# Altium schematic sheet battery_and_current_sense.SchDoc: Battery and current sense
size A4; SheetNumber: 8; SheetTotal: 20; TitleBig: Battery and current sense; Desc_line1: Two circuit variants that will be implemented but not used simultaneously. The usage of one over the other will come; Desc_line2: by component disponibility. INA219 current sensor is independent and common for both systems.
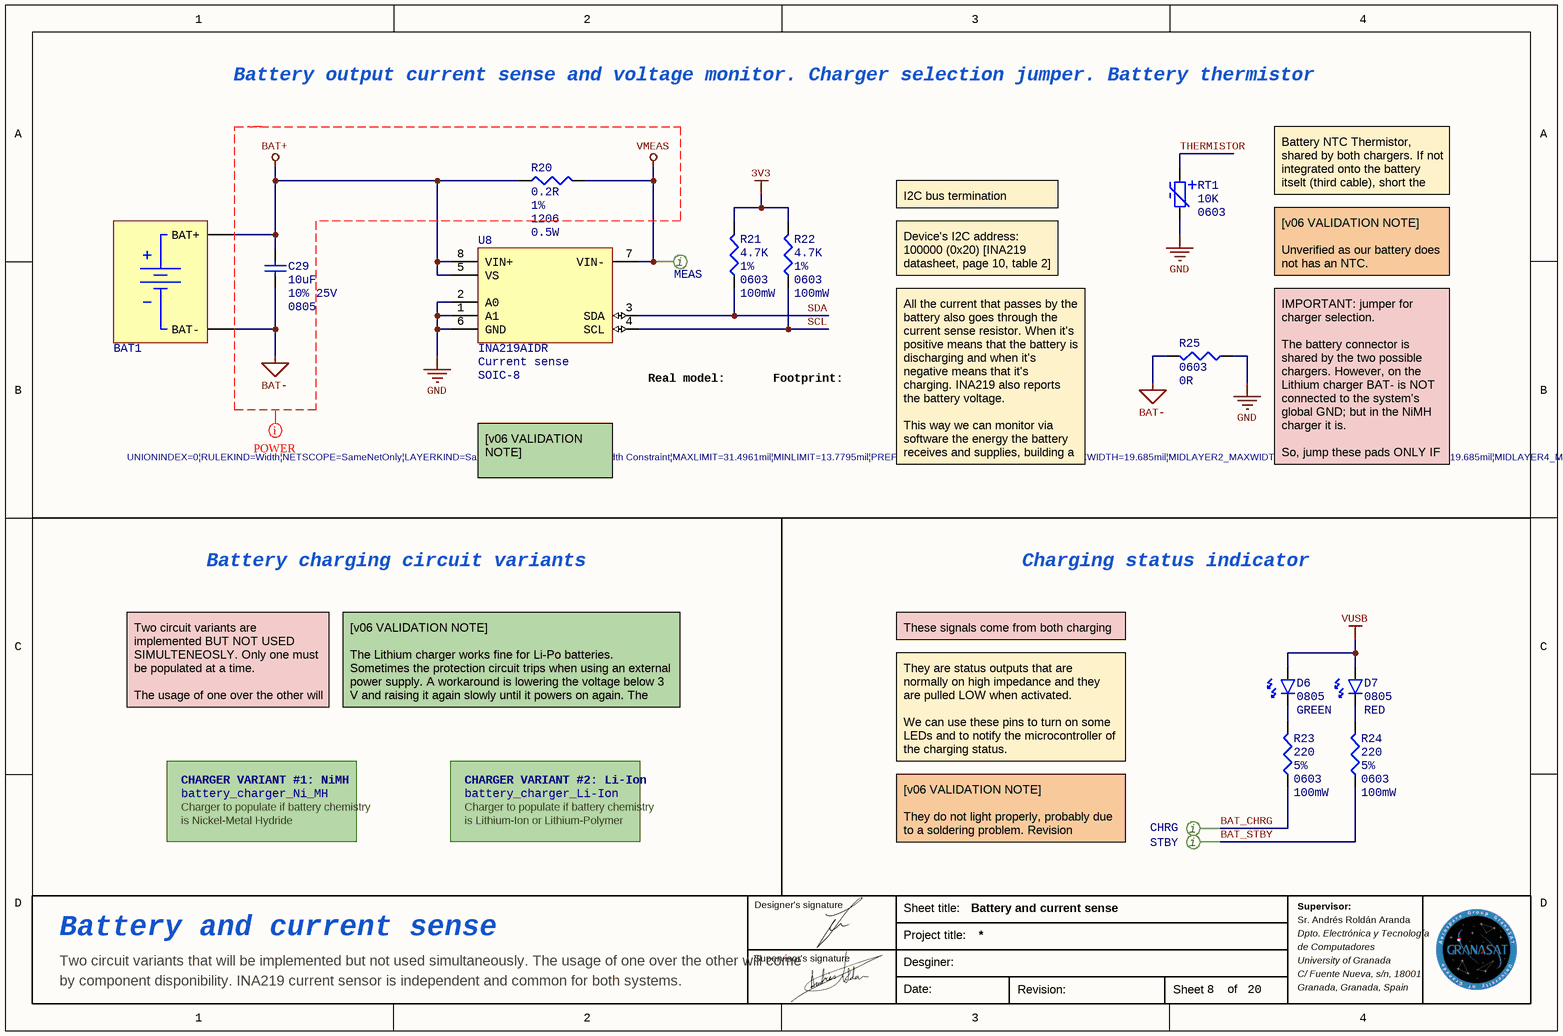
[diagram p0: battery_and_current_sense.SchDoc]

## Parts
BAT1  Battery pads  [BATTERY_PADS]  (value not drawn)  (no BOM)
C29  value 10uF  Tolerance: 10% 25V  PackageDescription: 0805  [CAP 0805_2012]  (hidden comment: Cap_cer_0805)
CHRG  Test Point Pad dual sided  [TEST POINT PAD]  (value not drawn)  (no BOM)
D6  PackageDescription: 0805  Type: GREEN  [LED 0805_2012 GREEN]  (hidden comment: Diode LED_G_0805)
D7  PackageDescription: 0805  Type: RED  [LED 0805_2012 RED]  (hidden comment: Diode LED_R_0805)
MEAS  Test Point Pad dual sided  [TEST POINT PAD]  (value not drawn)  (no BOM)
R20  value 0.2R  Tolerance: 1%  PackageDescription: 1206  PowerDisipated: 0.5W  [RES 1206_3216]  (hidden comment: sense)
R21  value 4.7K  Tolerance: 1%  PackageDescription: 0603  PowerDisipated: 100mW  [RES 0603_1608]  (hidden comment: Res_0603_4.7K_1%_100mW)
R22  value 4.7K  Tolerance: 1%  PackageDescription: 0603  PowerDisipated: 100mW  [RES 0603_1608]  (hidden comment: Res_0603_4.7K_1%_100mW)
R23  value 220  Tolerance: 5%  PackageDescription: 0603  PowerDisipated: 100mW  [RES 0603_1608]  (hidden comment: Res_0603_220_5%_100mW)
R24  value 220  Tolerance: 5%  PackageDescription: 0603  PowerDisipated: 100mW  [RES 0603_1608]  (hidden comment: Res_0603_220_5%_100mW)
R25  value 0R  PackageDescription: 0603  [RES 0603_1608]  (hidden comment: Res_0603_0ohm)
RT1  value 10K  PackageDescription: 0603  [NTC THT ver]  (hidden comment: NTC 10K tht)
STBY  Test Point Pad dual sided  [TEST POINT PAD]  (value not drawn)  (no BOM)
U8  Part: INA219AIDR  Type: Current sense  PackageDescription: SOIC-8  [SOIC-8-D0008A INA219D]  (hidden comment: INA219)

## Sub-sheets
CHARGER VARIANT #1: NiMH = battery_charger_Ni_MH: no entries
CHARGER VARIANT #2: Li-Ion = battery_charger_Li-Ion: no entries

## Nets
3V3: R21.2 R22.2
BAT+: BAT1.2(BAT+) C29.2 R20.1 U8.5(VS) U8.8(VIN+)
BAT-: BAT1.1(BAT-) C29.1 R25.2
GND: R25.1 RT1.2 U8.1(A1) U8.2(A0) U8.6(GND)
VMEAS: MEAS.1 R20.2 U8.7(VIN-)
VUSB: D6.1 D7.1
BAT_CHRG: CHRG.1 R23.1
BAT_STBY: R24.1 STBY.1
SCL: R22.1 U8.4(SCL)
SDA: R21.1 U8.3(SDA)
THERMISTOR: RT1.1
NetD6_2: D6.2 R23.2
NetD7_2: D7.2 R24.2

## Layout directives
net class POWER; rule Width Constraint [Pref Width = 0.5mm    Min Width = 0.35mm    Max Width = 0.8mm]: BAT+, BAT-, VMEAS

## Notes on the sheet
- Battery output current sense and voltage monitor. Charger selection jumper. Battery thermistor
- I2C bus termination resistors
- Battery NTC Thermistor, shared by both chargers. If not integrated onto the battery itselt (third cable), short the pads.
- Device's I2C address: 100000 (0x20) [INA219 datasheet, page 10, table 2]
- [v06 VALIDATION NOTE]
  Unverified as our battery does not has an NTC.
- (near U8) Real model:
- Footprint:
- [v06 VALIDATION NOTE]
  Works correctly.
- All the current that passes by the battery also goes through the current sense resistor. When it's positive means that the battery is discharging and when it's negative means that it's charging. INA219 also reports the battery voltage.
  This way we can monitor via software the energy the battery receives and supplies, building a BMS (Battery Monitoring System)
- IMPORTANT: jumper for charger selection.
  The battery connector is shared by the two possible chargers. However, on the Lithium charger BAT- is NOT connected to the system's global GND; but in the NiMH charger it is.
  So, jump these pads ONLY IF USING THE NiMH charger.
- Battery charging circuit variants
- Charging status indicator
- These signals come from both charging IC's.
- Two circuit variants are implemented BUT NOT USED SIMULTENEOSLY. Only one must be populated at a time.
  The usage of one over the other will come by component disponibility.
- [v06 VALIDATION NOTE]
  The Lithium charger works fine for Li-Po batteries. Sometimes the protection circuit trips when using an external power supply. A workaround is lowering the voltage below 3 V and raising it again slowly until it powers on again. The Ni-MH charger remains untested.
- They are status outputs that are normally on high impedance and they are pulled LOW when activated.
  We can use these pins to turn on some LEDs and to notify the microcontroller of the charging status.
- Charger to populate if battery chemistry
- is Nickel-Metal Hydride
- is Lithium-Ion or Lithium-Polymer
- [v06 VALIDATION NOTE]
  They do not light properly, probably due to a soldering problem. Revision pending.
- Designer's signature
- Sheet title:
- Sr. Andrés Roldán Aranda
- Supervisor:
- Supervisor's signature
- Project title:
- Desginer:
- Dpto. Electrónica y Tecnología
- de Computadores
- University of Granada
- C/ Fuente Nueva, s/n, 18001
- Granada, Granada, Spain
- Date:
- Revision:
- Sheet
- of
- (in symbol Test Point Pad dual sided) i

## Library data of the parts
BAT1 = Battery pads: Generic 2-Pad battery connector
C29 = Cap_cer_0805_10uF_10%: Ceramic cap size 0805; FabGroup: Battery; FabOrder: 7
CHRG MEAS STBY = Test Point Pad dual sided: Test point - PCB Pad dual sided
D6 = Diode LED_G_0805: Low power LED color Green; FabGroup: Charging status; FabOrder: 5
D7 = Diode LED_R_0805: Low power LED color Red; FabGroup: Charging status; FabOrder: 5
R20 = Res_1206_0R2_1%_500mW: Res size 1206 SMD mounting, high power, shunt, current sense.
R21 R22 = Res_0603_4.7K_1%_100mW: Res size 0603 SMD mounting, low power
R23 R24 = Res_0603_220_5%_100mW: Res size 0603 SMD mounting, low power
R25 = Res_0603_0ohm: Res size 0603 SMD mounting, zero-ohm 0R Yageo RC0603JR-070RL; Tolerance: 5%; PowerDisipated: 100mW; FabGroup: Battery; FabOrder: 7
RT1 = NTC 10K tht: NTC THERMISTOR 10K for solding a cable from the battery NTC
U8 = IC INA219 current sense: Zero-Drift, Bi-Directional CURRENT/POWER MONITOR with I2C. SOIC-8 (D) Package